# EAGLE design usb-100basefx (EAGLE 6.4)
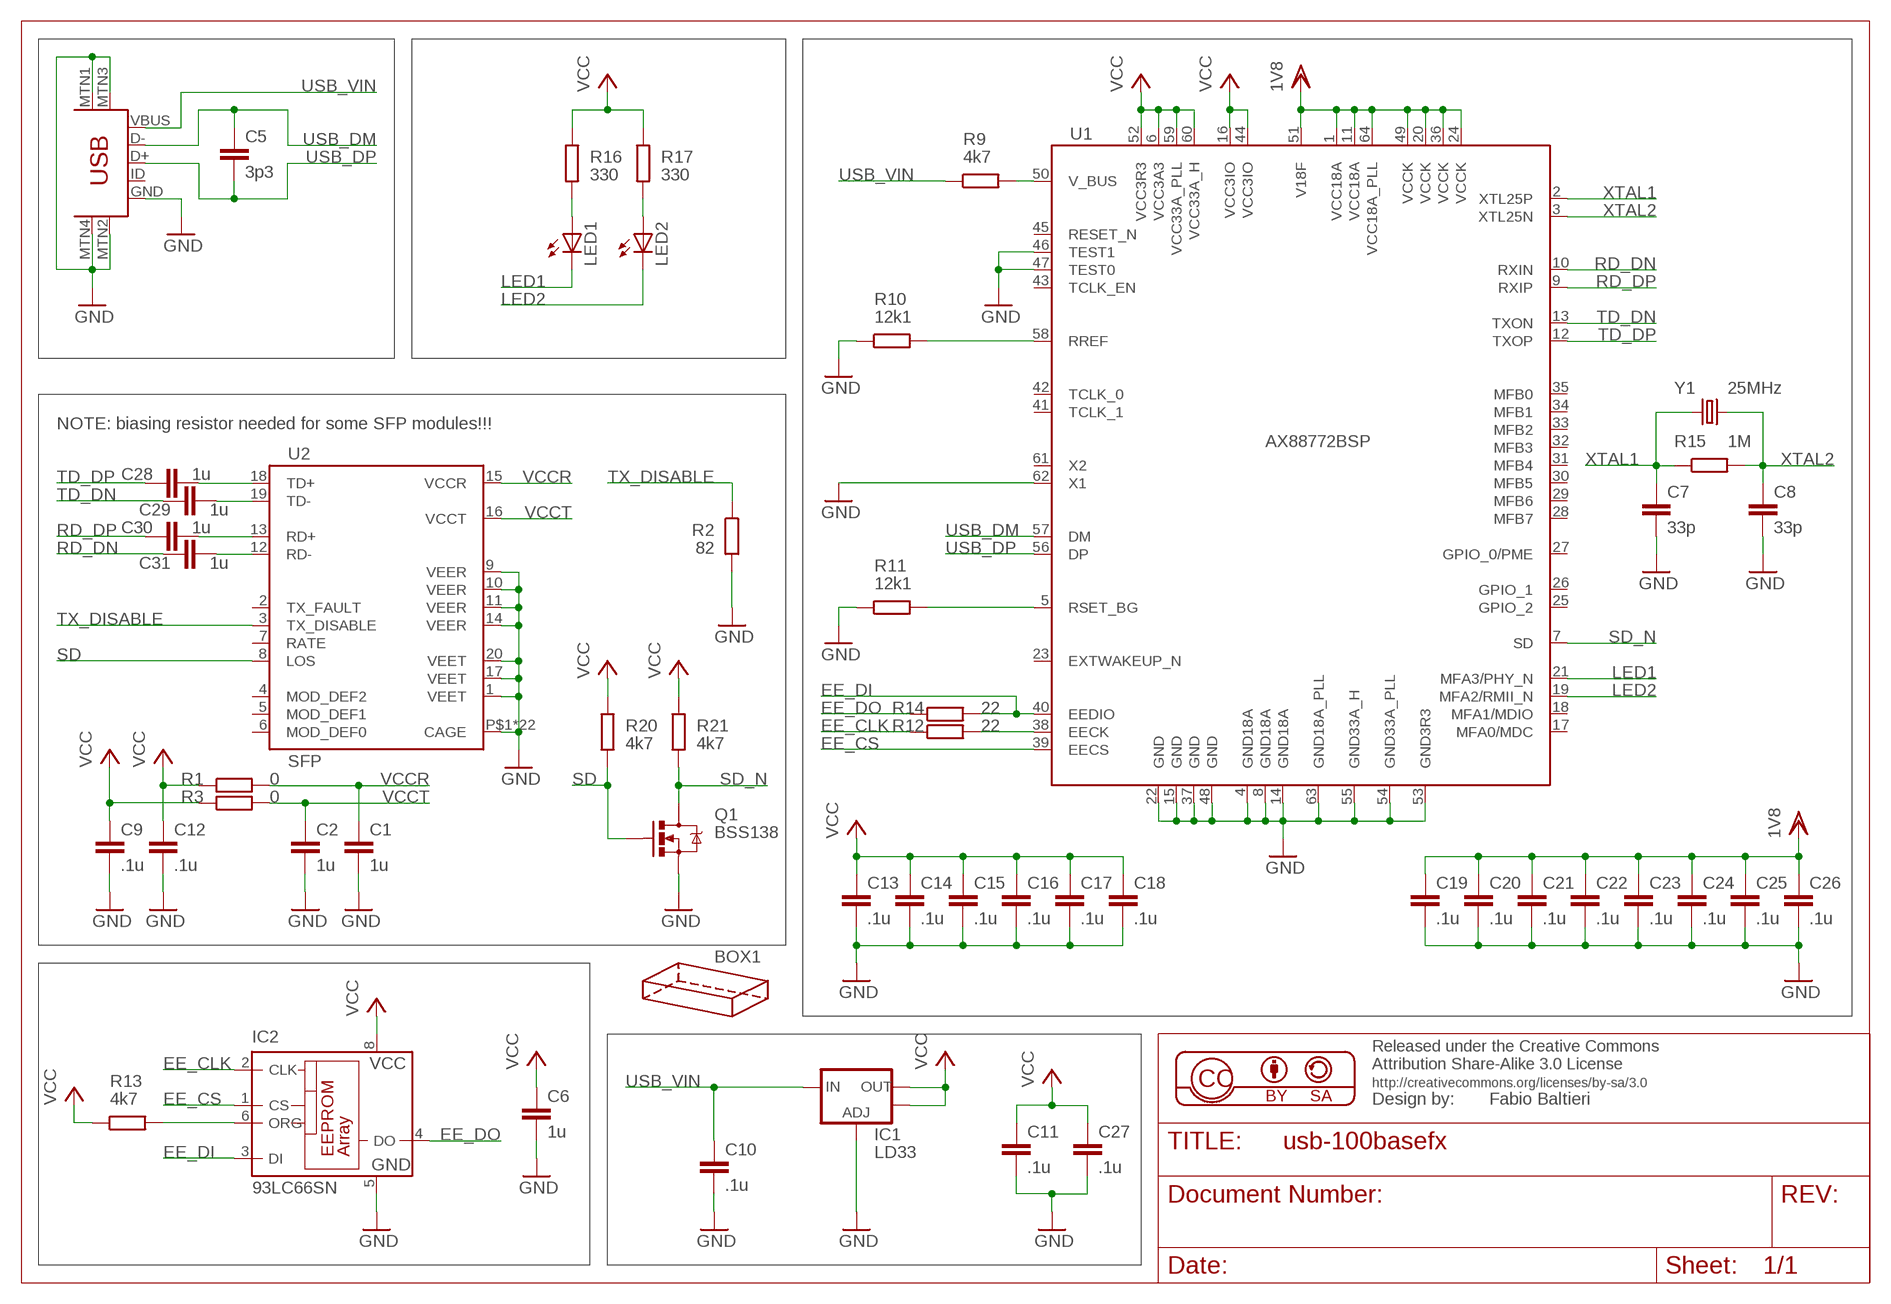
[diagram p0: schematic, sheet 1]

## Parts
BOX1  HAMMOND-BOX-H-1H  [1551H-1HOLE]
C1  1u  C-EUC0603  [C0603]
C2  1u  C-EUC0603  [C0603]
C5  3p3  C-EUC0603  [C0603]
C6  1u  C-EUC0603  [C0603]
C7  33p  C-EUC0603  [C0603]
C8  33p  C-EUC0603  [C0603]
C9  .1u  C-EUC0603  [C0603]
C10  .1u  C-EUC0603  [C0603]
C11  .1u  C-EUC0603  [C0603]
C12  .1u  C-EUC0603  [C0603]
C13  .1u  C-EUC0603  [C0603]
C14  .1u  C-EUC0603  [C0603]
C15  .1u  C-EUC0603  [C0603]
C16  .1u  C-EUC0603  [C0603]
C17  .1u  C-EUC0603  [C0603]
C18  .1u  C-EUC0603  [C0603]
C19  .1u  C-EUC0603  [C0603]
C20  .1u  C-EUC0603  [C0603]
C21  .1u  C-EUC0603  [C0603]
C22  .1u  C-EUC0603  [C0603]
C23  .1u  C-EUC0603  [C0603]
C24  .1u  C-EUC0603  [C0603]
C25  .1u  C-EUC0603  [C0603]
C26  .1u  C-EUC0603  [C0603]
C27  .1u  C-EUC0603  [C0603]
C28  1u  C-EUC0603  [C0603]
C29  1u  C-EUC0603  [C0603]
C30  1u  C-EUC0603  [C0603]
C31  1u  C-EUC0603  [C0603]
IC1  LD33  V_REG_LM1117SOT223  [SOT223]
IC2  93LC66SN  [SO-08]
LED1  LEDCHIPLED_0805  [CHIPLED_0805]
LED2  LEDCHIPLED_0805  [CHIPLED_0805]
Q1  BSS138  MOSFET-NCHANNELBSS123LT1G  [SOT23]
R1  0  R-EU_R0603  [R0603]
R2  82  R-EU_R0603  [R0603]
R3  0  R-EU_R0603  [R0603]
R9  4k7  R-EU_R0603  [R0603]
R10  12k1  R-EU_R0603  [R0603]
R11  12k1  R-EU_R0603  [R0603]
R12  22  R-EU_R0603  [R0603]
R13  4k7  R-EU_R0603  [R0603]
R14  22  R-EU_R0603  [R0603]
R15  1M  R-EU_R0603  [R0603]
R16  330  R-EU_R0603  [R0603]
R17  330  R-EU_R0603  [R0603]
R20  4k7  R-EU_R0603  [R0603]
R21  4k7  R-EU_R0603  [R0603]
U1  AX88772BSP  [LQFP64-0.4MM-SHORTPAD]
U2  SFP  [SFP]
U$1  USB-MINIB-5PIN  [USB-MINIB]
Y1  25MHz  CRYSTAL5X3  [CRYSTAL-SMD-5X3]

## Nets
EE_CLK: IC2.2(CLK) R12.1
EE_CS: IC2.1(CS) U1.39(EECS)
EE_DI: IC2.3(DI) R14.2 U1.40(EEDIO)
EE_DO: IC2.4(DO) R14.1
GND: C1.2 C2.2 C6.2 C7.2 C8.2 C9.2 C10.2 C11.2 C12.2 C13.2 C14.2 C15.2 C16.2 C17.2 C18.2 C19.2 C20.2 C21.2 C22.2 C23.2 C24.2 C25.2 C26.2 C27.2 IC1.1(ADJ) IC2.5(GND) Q1.2(S) R2.2 R10.1 R11.1 U1.4(GND18A) U1.8(GND18A) U1.14(GND18A) U1.15(GND) U1.22(GND) U1.37(GND) U1.46(TEST1) U1.47(TEST0) U1.48(GND) U1.53(GND3R3) U1.54(GND33A_PLL) U1.55(GND33A_H) U1.62(X1) U1.63(GND18A_PLL) U2.1(VEET) U2.9(VEER) U2.10(VEER) U2.11(VEER) U2.14(VEER) U2.17(VEET) U2.20(VEET) U2.P$1(CAGE) U2.P$2(CAGE) U2.P$3(CAGE) U2.P$4(CAGE) U2.P$5(CAGE) U2.P$6(CAGE) U2.P$7(CAGE) U2.P$8(CAGE) U2.P$9(CAGE) U2.P$10(CAGE) U2.P$11(CAGE) U2.P$12(CAGE) U2.P$13(CAGE) U2.P$14(CAGE) U2.P$15(CAGE) U2.P$16(CAGE) U2.P$17(CAGE) U2.P$18(CAGE) U2.P$19(CAGE) U2.P$20(CAGE) U2.P$21(CAGE) U2.P$22(CAGE) U$1.GND U$1.MTN1(MTN2) U$1.MTN2(MTN3) U$1.MTN3(MTN1) U$1.MTN4
LED1: LED1.C U1.21(MFA3/PHY_N)
LED2: LED2.C U1.19(MFA2/RMII_N)
N$1: R9.2 U1.50(V_BUS)
N$2: R10.2 U1.58(RREF)
N$3: R11.2 U1.5(RSET_BG)
N$4: R12.2 U1.38(EECK)
N$5: IC2.6(ORG) R13.2
N$6: LED1.A R16.2
N$7: LED2.A R17.2
N$8: C29.2 U2.19(TD-)
N$9: C28.2 U2.18(TD+)
N$10: C30.2 U2.13(RD+)
N$11: C31.2 U2.12(RD-)
RD_DN: C31.1 U1.10(RXIN)
RD_DP: C30.1 U1.9(RXIP)
SD: Q1.1(G) R20.2 U2.8(LOS)
SD_N: Q1.3(D) R21.2 U1.7(SD)
TD_DN: C29.1 U1.13(TXON)
TD_DP: C28.1 U1.12(TXOP)
TX_DISABLE: R2.1 U2.3(TX_DISABLE)
USB_DM: C5.1 U1.57(DM) U$1.D-
USB_DP: C5.2 U1.56(DP) U$1.D+
USB_VIN: C10.1 IC1.3(IN) R9.1 U$1.VBUS
VCC: C6.1 C9.1 C11.1 C12.1 C13.1 C14.1 C15.1 C16.1 C17.1 C18.1 C27.1 IC1.2(OUT) IC1.4(OUT) IC2.8(VCC) R1.1 R3.1 R13.1 R16.1 R17.1 R20.1 R21.1 U1.6(VCC3A3) U1.16(VCC3IO) U1.44(VCC3IO) U1.52(VCC3R3) U1.59(VCC33A_PLL) U1.60(VCC33A_H)
VCCR: C1.1 R1.2 U2.15(VCCR)
VCCT: C2.1 R3.2 U2.16(VCCT)
VDD: C19.1 C20.1 C21.1 C22.1 C23.1 C24.1 C25.1 C26.1 U1.1(VCC18A) U1.11(VCC18A) U1.20(VCCK) U1.24(VCCK) U1.36(VCCK) U1.49(VCCK) U1.51(V18F) U1.64(VCC18A_PLL) ; supply symbol labelled 1V8
XTAL1: C7.1 R15.1 U1.2(XTL25P) Y1.1
XTAL2: C8.1 R15.2 U1.3(XTL25N) Y1.3
Unconnected: IC2.7(NU) U1.17(MFA0/MDC) U1.18(MFA1/MDIO) U1.23(EXTWAKEUP_N) U1.25(GPIO_2) U1.26(GPIO_1) U1.27(GPIO_0/PME) U1.28(MFB7) U1.29(MFB6) U1.30(MFB5) U1.31(MFB4) U1.32(MFB3) U1.33(MFB2) U1.34(MFB1) U1.35(MFB0) U1.41(TCLK_1) U1.42(TCLK_0) U1.43(TCLK_EN) U1.45(RESET_N) U1.61(X2) U2.2(TX_FAULT) U2.4(MOD_DEF2) U2.5(MOD_DEF1) U2.6(MOD_DEF0) U2.7(RATE) U$1.ID

## Notes on the sheet
- NOTE: biasing resistor needed for some SFP modules!!!

## Library data of the parts
BOX1 = hammond:HAMMOND-BOX: Hammond Project boxes Hammond 1551 Transluscent Blue 50x35x20mm 1551GTBU http://www.hammondmfg.com/pdf/1551G.pdf Hammond 1551 Transluscent Blue 50x50x20mm 1551RTBU http://www.hammondmfg.com/pdf/1551R.pdf Hammond 1551 Transluscent Blue 60x35x20mm 1551HTBU http://www.hammondmfg.com/pdf/1551H.pdf Hammond 1551 Transluscent Blue 80x40x20mm 1551KTBU http://www.hammondmfg.com/pdf/1551K.pdf Hammond 1591 Transluscent Blue 100x51x22m m 1591XXATBU http://www.hammondmfg.com/pdf/1591XXA.pdf
C1 C2 C5-C31 = rcl:C-EU: CAPACITOR, European symbol
IC1 = SparkFun-PowerIC:V_REG_LM1117: Voltage Regulator LM1117 Standard adjustable voltage regulator but in SMD form. Spark Fun Electronics SKU : COM-00595
IC2 = microchip:93*: Serial EPROM 1 K/2 K/4 K, low voltage, Microwire; MF: MICROCHIP; MPN: 93LC66/SN; OC_FARNELL: 1296586; OC_NEWARK: 65K1154
LED1 LED2 = led:LED: LED OSRAM: - CHIPLED LG R971, LG N971, LY N971, LG Q971, LY Q971, LO R971, LY R971 LH N974, LH R974 LS Q976, LO Q976, LY Q976 LO Q996 - Hyper CHIPLED LW Q18S LB Q993, LB Q99A, LB R99A - SideLED LS A670, LO A670, LY A670, LG A670, LP A670 LB A673, LV A673, LT A673, LW A673 LH A674 LY A675 LS A676, LA A676, LO A676, LY A676, LW A676 LS A679, LY A679, LG A679 - Hyper Micro SIDELED® LS Y876, LA Y876, LO Y876, LY Y876 LT Y87S - SmartLED LW L88C, LW L88S LB L89C, LB L89S, LG L890 LS L89K, LO L89K, LY L89K LS L896, LA L896, LO L896, LY L896 - TOPLED LS T670, LO T670, LY T670, LG T670, LP T670 LSG T670, LSP T670, LSY T670, LOP T670, LYG T670 LG T671, LOG T671, LSG T671 LB T673, LV T673, LT T673, LW T673 LH T674 LS T676, LA T676, LO T676, LY T676, LB T676, LH T676, LSB T676, LW T676 LB T67C, LV T67C, LT T67C, LS T67K, LO T67K, LY T67K, LW E67C LS E67B, LA E67B, LO E67B, LY E67B, LB E67C, LV E67C, LT E67C LW T67C LS T679, LY T679, LG T679 LS T770, LO T770, LY T770, LG T770, LP T770 LB T773, LV T773, LT T773, LW T773 LH T774 LS E675, LA E675, LY E675, LS T675 LS T776, LA T776, LO T776, LY T776, LB T776 LHGB T686 LT T68C, LB T68C - Hyper Mini TOPLED® LB M676 - Mini TOPLED Santana® LG M470 LS M47K, LO M47K, LY M47K Source: http://www.osram.convergy.de LUXEON: - LUMILED® LXK2-PW12-R00, LXK2-PW12-S00, LXK2-PW14-U00, LXK2-PW14-V00 LXK2-PM12-R00, LXK2-PM12-S00, LXK2-PM14-U00 LXK2-PE12-Q00, LXK2-PE12-R00, LXK2-PE12-S00, LXK2-PE14-T00, LXK2-PE14-U00 LXK2-PB12-K00, LXK2-PB12-L00, LXK2-PB12-M00, LXK2-PB14-N00, LXK2-PB14-P00, LXK2-PB14-Q00 LXK2-PR12-L00, LXK2-PR12-M00, LXK2-PR14-Q00, LXK2-PR14-R00 LXK2-PD12-Q00, LXK2-PD12-R00, LXK2-PD12-S00 LXK2-PH12-R00, LXK2-PH12-S00 LXK2-PL12-P00, LXK2-PL12-Q00, LXK2-PL12-R00 Source: www.luxeon.com KINGBRIGHT: KA-3528ASYC Source: www.kingbright.com
Q1 = SparkFun-DiscreteSemi:MOSFET-NCHANNEL: Common NMOSFET Parts MFG P/N Store ID Prod ID FDD8780 TRANS-09984 SI7820DN TRANS-11055 FDS6630A IC-08089 2N7002PW TRANS-11151 FQP30N06L COM-10213 TRANS-10060 BSS123LT1G TRANS-08345 BSS138 TRANS-00830 BS170 2N7000; PROD_ID: TRANS-08345
R1-R3 R9-R17 R20 R21 = rcl:R-EU_: RESISTOR, European symbol
U1 = balto:AX88772B: AX88772BLF / AX88772BLI Low-power
U2 = balto:SFP: SFP Cage and Connector
U$1 = SparkFun-Connectors:USB-MINIB: Mini-USB "B" connector with 5th pin broken out. Created new symbol breaking out 5th "ID" pin in mini/micro USB connector spec. See: http://en.wikipedia.org/wiki/Mini_usb#Cables. Uses same footprint as 4-pin symbol. Also added pins to connect to mounting / shield pads if required (probably not generally needed as signals aren't shielded once they leave the connector).
Y1 = SparkFun-FreqCtrl:CRYSTAL: Various standard crystals. Proven footprints. Spark Fun Electronics SKU : COM-00534

## Board
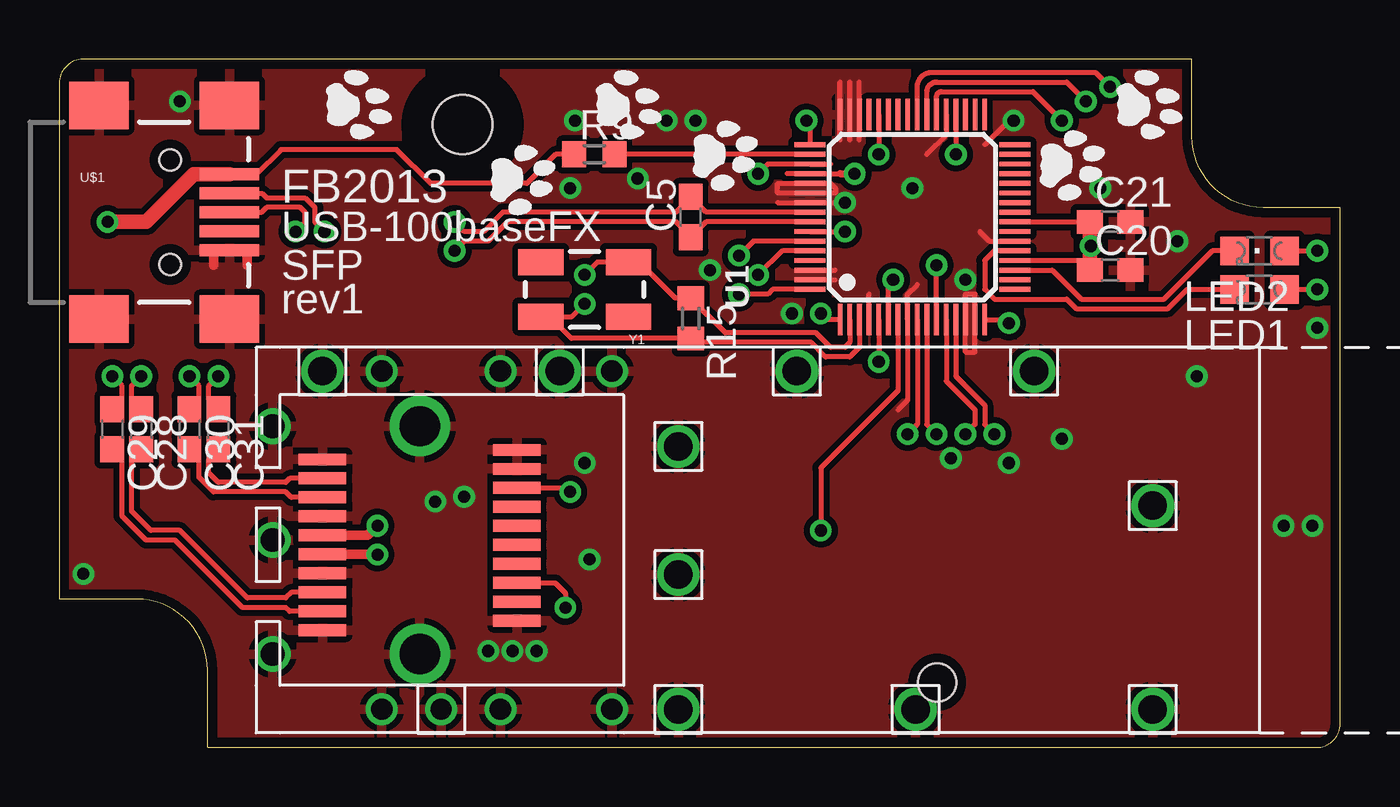
[diagram p1: board, top side]
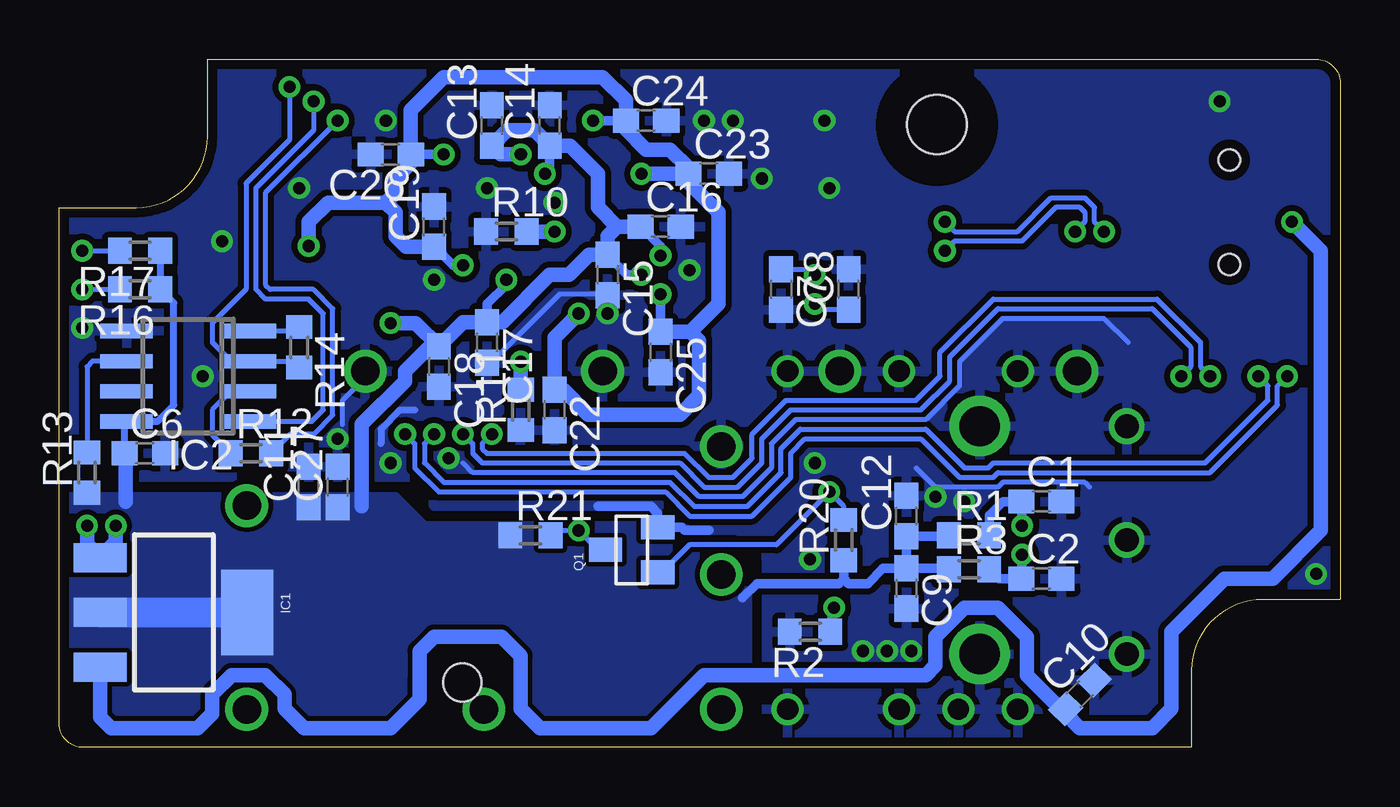
[diagram p2: board, bottom side, seen from below]

Size 54 x 29 mm. Coordinates in mm from the lower left corner, seen from the top.
Copper layers (1*16): Top 0.035mm / dielectric 1.5mm / Bottom 0.035mm
Design rules "balto": minimum track width 8mil, minimum drill 20mil, track to track 8mil, track to pad 8mil, pad to pad 8mil, via to via 8mil, smd to smd 8mil, copper to edge 16mil, drill to drill 8mil, minimum pad ring 8mil, minimum via ring 8mil, stop-mask expansion 2mil, vias tented up to drill 20mil, thermal gap 10mil
Holes 1.6 mm at 37.01,2.74

### Footprints (pad centres in the part's own frame; a part is rotated, then mirrored left to right if it is on the bottom)
1551H-1HOLE = hole 2.5: 17,26.25
C0603 = smd 1.1 x 1: 1 -0.85,0; 2 0.85,0
SOT223 = smd 1.219 x 2.235: 1 -2.311,-3.099; 2 0,-3.099; 3 2.311,-3.099 | smd 3.6 x 2.2: 4 0,3.099
SO-08 = smd 0.6 x 2.2: 1 -1.905,-2.6; 2 -0.635,-2.6; 3 0.635,-2.6; 4 1.905,-2.6; 5 1.905,2.6; 6 0.635,2.6; 7 -0.635,2.6; 8 -1.905,2.6
CHIPLED_0805 = smd 1.2 x 1.2: A 0,-1.05; C 0,1.05
SOT23 = smd 1 x 1.4: 1 -0.95,-1.1; 2 0.95,-1.1; 3 0,1.1
R0603 = smd 1 x 1.1: 1 -0.85,0; 2 0.85,0
LQFP64-0.4MM-SHORTPAD = smd 0.203 x 1.321: 1 -3.048,-4.318; 2 -2.642,-4.318; 3 -2.235,-4.318; 4 -1.829,-4.318; 5 -1.422,-4.318; 6 -1.016,-4.318; 7 -0.61,-4.318; 8 -0.203,-4.318; 9 0.203,-4.318; 10 0.61,-4.318; 11 1.016,-4.318; 12 1.422,-4.318; 13 1.829,-4.318; 14 2.235,-4.318; 15 2.642,-4.318; 16 3.048,-4.318; 33 3.048,4.318; 34 2.642,4.318; 35 2.235,4.318; 36 1.829,4.318; 37 1.422,4.318; 38 1.016,4.318; 39 0.61,4.318; 40 0.203,4.318; 41 -0.203,4.318; 42 -0.61,4.318; 43 -1.016,4.318; 44 -1.422,4.318; 45 -1.829,4.318; 46 -2.235,4.318; 47 -2.642,4.318; 48 -3.048,4.318 | smd 1.321 x 0.203: 17 4.318,-3.048; 18 4.318,-2.642; 19 4.318,-2.235; 20 4.318,-1.829; 21 4.318,-1.422; 22 4.318,-1.016; 23 4.318,-0.61; 24 4.318,-0.203; 25 4.318,0.203; 26 4.318,0.61; 27 4.318,1.016; 28 4.318,1.422; 29 4.318,1.829; 30 4.318,2.235; 31 4.318,2.642; 32 4.318,3.048; 49 -4.318,3.048; 50 -4.318,2.642; 51 -4.318,2.235; 52 -4.318,1.829; 53 -4.318,1.422; 54 -4.318,1.016; 55 -4.318,0.61; 56 -4.318,0.203; 57 -4.318,-0.203; 58 -4.318,-0.61; 59 -4.318,-1.016; 60 -4.318,-1.422; 61 -4.318,-1.829; 62 -4.318,-2.235; 63 -4.318,-2.642; 64 -4.318,-3.048
SFP = smd 2 x 0.5: 1 31.3,3.4; 2 31.3,2.6; 3 31.3,1.8; 4 31.3,1; 5 31.3,0.2; 6 31.3,-0.6; 7 31.3,-1.4; 8 31.3,-2.2; 9 31.3,-3; 10 31.3,-3.8; 11 39.5,-3.4; 12 39.5,-2.6; 13 39.5,-1.8; 14 39.5,-1; 15 39.5,-0.2; 16 39.5,0.6; 17 39.5,1.4; 18 39.5,2.2; 19 39.5,3; 20 39.5,3.8 | drill 1: P$1 41.6,0; P$2 41.6,-4.8; P$3 41.6,4.8 | drill 0.9: P$4 34.5,7.13; P$6 37,7.13; P$7 37,-7.12; P$8 32,7.13; P$9 32,-7.12; P$11 27.3,7.13; P$12 27.3,-7.12 | drill 1.2: P$5 29.5,-7.12; P$10 39.5,-7.12; P$13 24.5,7.13; P$14 24.5,1.45; P$15 14.5,7.13; P$16 24.5,-3.95; P$17 4.5,7.13; P$18 4.5,-1.45; P$19 19.5,-7.12; P$20 9.5,-7.12 | drill 1.7: P$21 35.4,-4.8; P$22 35.4,4.8
USB-MINIB = smd 2.5 x 0.5: D+ 2.5,0; D- 2.5,0.8; GND 2.5,-1.6; ID 2.5,-0.8; VBUS 2.5,1.6 | smd 2.5 x 2: MTN1 -3,4.5; MTN2 2.5,4.5; MTN3 -3,-4.5; MTN4 2.5,-4.5 | hole 0.9: 0,2.2; 0,-2.2
CRYSTAL-SMD-5X3 = smd 1.9 x 1.1: 1 -1.85,-1.15; 2 1.85,-1.15; 3 1.85,1.15; 4 -1.85,1.15

### Placement (x,y rotation side)
BOX1  0,0 0 top
C1  12.6,10.36 0 bottom
C2  12.6,7.11 0 bottom
C5  26.62,22.35 90 top
C6  50.39,12.4 0 bottom
C7  23.57,19.3 270 bottom
C8  20.73,19.3 90 bottom
C9  18.29,6.71 270 bottom
C10  10.97,2.24 45 bottom
C11  43.48,10.97 90 bottom
C12  18.29,9.75 90 bottom
C13  35.76,26.21 90 bottom
C14  33.32,26.21 90 bottom
C15  30.89,19.91 270 bottom
C16  28.65,21.95 0 bottom
C17  35.97,17.07 270 bottom
C18  38,16.05 270 bottom
C19  38.2,21.95 90 bottom
C20  44.3,20.12 0 top
C21  44.3,22.15 0 top
C22  33.12,14.22 270 bottom
C23  26.62,24.18 0 bottom
C24  29.26,26.42 0 bottom
C25  28.65,16.66 270 bottom
C26  40.03,24.99 180 bottom
C27  42.27,10.97 90 bottom
C28  3.45,13.41 270 top
C29  2.24,13.41 270 top
C30  5.49,13.41 270 top
C31  6.71,13.41 270 top
IC1  49.17,5.69 270 bottom
IC2  48.56,15.65 90 bottom
LED1  50.6,19.3 90 top
LED2  50.6,20.93 90 top
Q1  29.87,8.33 90 bottom
R1  15.65,8.94 0 bottom
R2  22.35,4.88 180 bottom
R3  15.65,7.52 0 bottom
R9  22.56,24.99 0 top
R10  35.15,21.74 0 bottom
R11  34.54,14.22 90 bottom
R12  45.92,12.4 0 bottom
R13  52.83,11.58 90 bottom
R14  43.89,16.87 270 bottom
R15  26.62,18.08 270 top
R16  50.6,19.3 180 bottom
R17  50.6,20.93 180 bottom
R20  20.93,8.74 90 bottom
R21  34.14,8.94 0 bottom
U1  35.97,22.35 0 top
U2  50.6,8.74 180 top
U$1  4.67,22.56 0 top
U$2  [CAT-L]  12.19,27.03 270 top
U$3  [CAT-R]  19.1,23.98 270 top
U$4  [CAT-L]  23.57,27.03 270 top
U$5  [CAT-R]  27.64,24.99 270 top
U$7  [CAT-R]  42.27,24.59 270 top
U$8  [CAT-L]  45.52,27.03 270 top
Y1  22.15,19.3 180 top

### Tracks (layer width: path | path; a pad name or v marks a point on that pad's centre or on a via)
EE_CLK
  Bottom 0.203: 45.09,15.01 IC2.2 46.76,15.01 47.55,14.22 47.55,13.17 R12.1
EE_CS  (via drill 0.51)
  Top 0.203: U1.39 36.58,27.64 arc-90 36.98,28.04 42.47,28.04 v43.28,27.23
  Bottom 0.203: v43.28,27.23 43.28,26.01 45.72,23.57 45.72,19.3 45.31,18.9 43.48,18.9 42.88,18.29 42.88,14.22 43.36,13.74 IC2.1
EE_DI  (via drill 0.51)
  Top 0.203: U1.40 36.17,27.84 arc-90 36.78,28.45 43.69,28.45 v44.3,27.84
  Bottom 0.203: v44.3,27.84 44.3,25.6 46.13,23.77 46.13,19.3 47.55,17.88 47.55,17.07 46.76,16.28 IC2.3 44.16,16.28 R14.2 43.85,16.02
EE_DO
  Bottom 0.203: IC2.4 44.05,17.55 R14.1
GND  (via drill 0.51)
  Top 0.203: U1.62 32.72,20.12 | U1.63 32.72,19.71 | 32.72,22.96 U1.55 30.28,22.96 | 32.92,25.6 U1.48 32.92,28.04 | 33.33,25.6 U1.47 33.33,28.04 | 33.73,25.6 U1.46 33.73,28.04 | U1.37 37.39,25.81 36.58,24.99 | U1.22 39.22,21.34 38.81,21.74 | U1.4 34.14,19.1 | 36.17,19.51 35.76,19.1 U1.8 35.76,14.63 35.36,14.22 | v40.23,26.42 40.03,26.42 39.01,25.4 | U1.54 32.72,23.37 32.72,23.57 32.51,23.77 U1.53 30.28,23.77 30.28,23.37 U1.54 | U1.14 38.2,19.1 38.61,19.1 U1.15 38.61,16.66 38.2,16.66 U1.14
  Top 0.406: 7.92,20.32 7.92,20.95 U$1.GND 6.5,20.95 6.5,20.32
  Bottom 0.203: 8.94,17.07 9.96,18.09 14.22,18.09 16.05,16.26 16.05,15.24 17.48,13.82 22.96,13.82 23.98,12.8 23.98,11.79 25.2,10.57 27.03,10.57 28.04,11.58 36.58,11.58 36.98,11.99 | 10.57,10.97 10.77,11.18 14.22,11.18 14.43,10.97 17.07,10.97 17.88,11.79 | 31.09,19.1 32.92,19.1 35.76,16.26 | 42.06,13.61 42.06,14.63 41.25,15.44
  Bottom 0.305: 39.01,14.22 39.62,14.22 40.44,13.41 40.44,12.8
  Bottom 0.406: 31.29,10.16 29.06,10.16 28.77,9.87 Q1.2 27.77,9.28 27.64,9.14 26.62,9.14
  Bottom 0.61: v52.83,9.35 52.83,8.56 IC1.1 51.61,8.66 v51.61,9.35
  other vias: 5.08,27.23 35.97,23.57 27.43,20.12 43.89,23.57 47.14,21.34 38.2,19.71 47.96,15.65 26.82,26.42 25.6,26.42 21.74,26.42 21.54,23.57 24.38,23.98 33.12,22.96 30.89,18.29 53.04,17.68 1.02,7.32 37.59,12.19 18.08,4.06 19.1,4.06 20.12,4.06 42.27,13 22.35,7.92 17.07,10.57 15.85,10.36 22.15,11.99 40.03,11.99
  pour Top (isolate 0.254): 54.66,-0.61 54.66,30.07 -0.61,30.07 -0.61,-0.61
  pour Bottom (isolate 0.254): -0.2,-0.2 24.18,-0.2 24.18,7.92 25.4,9.14 27.64,9.14 28.65,10.16 38.2,10.16 39.42,11.38 54.25,11.38 54.25,29.67 -0.2,29.67
LED1
  Top 0.203: U1.21 39.42,20.93 39.01,20.52 39.01,19.3 39.42,18.9 42.47,18.9 42.88,18.49 46.74,18.49 47.55,19.3 LED1.C
LED2
  Top 0.203: U1.19 41.86,20.12 43.08,18.9 46.57,18.9 48.6,20.93 LED2.C
N$1
  Top 0.203: U1.50 R9.2
N$2  (via drill 0.51)
  Top 0.203: U1.58 v33.12,21.74
  Bottom 0.61: v33.12,21.74 R10.2
N$3  (via drill 0.51)
  Top 0.203: U1.5 v34.54,16.26
  Bottom 0.61: R11.2 v34.54,16.26
N$4  (via drill 0.51)
  Top 0.203: U1.38 36.98,27.43 arc-90 37.19,27.64 41.05,27.64 v42.27,26.42
  Bottom 0.203: v42.27,26.42 45.31,23.37 45.31,19.51 45.11,19.3 43.28,19.3 42.47,18.49 42.47,14.02 43.28,13.21 44.26,13.21 R12.2
N$5
  Bottom 0.203: IC2.6 52.6,16.28 52.83,16.05 R13.2
N$6  (via drill 0.51)
  Top 0.203: LED1.A v53.03,19.3
  Bottom 0.203: v53.03,19.3 R16.2
N$7  (via drill 0.51)
  Top 0.203: LED2.A v53.03,20.93
  Bottom 0.203: v53.03,20.93 R17.2
N$8
  Top 0.203: U2.19 9.71,5.74 9.55,5.89 7.72,5.89 4.88,8.74 3.66,8.74 2.64,9.75 2.64,12.15 C29.2
N$9
  Top 0.203: U2.18 9.79,6.54 9.55,6.3 7.92,6.3 5.08,9.14 3.86,9.14 3.05,9.96 3.05,12.15 C28.2
N$10
  Top 0.203: U2.13 9.78,10.54 9.55,10.77 6.5,10.77 5.89,11.38 5.89,12.15 C30.2
N$11
  Top 0.203: U2.12 9.71,11.34 9.55,11.18 6.71,11.18 6.3,11.58 6.3,12.15 C31.2
RD_DN  (via drill 0.51)
  Top 0.203: U1.10 36.58,13.61 v36.98,13.21 | C31.1 6.3,14.67 6.3,15.24 v6.71,15.65
  Bottom 0.203: v36.98,13.21 36.58,12.8 36.58,12.39 36.17,11.99 27.84,11.99 26.82,10.97 25.4,10.97 24.38,11.99 24.38,13.01 23.16,14.22 17.68,14.22 16.46,15.44 16.46,16.46 14.43,18.49 7.92,18.49 6.3,16.87 6.3,16.05 v6.71,15.65
RD_DP  (via drill 0.51)
  Top 0.203: U1.9 36.17,13.61 v35.76,13.21 | C30.1 5.89,14.67 5.89,15.24 v5.49,15.65
  Bottom 0.203: v35.76,13.21 36.17,12.8 36.17,12.6 35.97,12.39 27.64,12.39 26.62,11.38 25.6,11.38 24.79,12.19 24.79,13.21 23.37,14.63 17.88,14.63 16.87,15.65 16.87,16.66 14.63,18.9 7.72,18.9 5.89,17.07 5.89,16.05 v5.49,15.65
SD  (via drill 0.51)
  Top 0.203: U2.8 21.37,10.94 v21.54,10.77
  Bottom 0.203: R20.2 20.93,10.16 v21.54,10.77 23.77,8.53 27.43,8.53 28.25,7.72 28.43,7.72 Q1.1
SD_N  (via drill 0.51)
  Top 0.203: U1.7 35.36,15.04 32.11,11.79 v32.11,9.14
  Bottom 0.203: Q1.3 31.29,8.33 v32.11,9.14 33.08,9.14 R21.2
TD_DN  (via drill 0.51)
  Top 0.203: U1.13 37.8,15.65 39.01,14.43 39.01,13.61 v39.42,13.21 | C29.1 2.64,14.67 2.64,15.24 v2.23,15.65
  Bottom 0.203: v39.42,13.21 39.01,12.8 39.01,11.79 38,10.77 28.45,10.77 27.43,9.75 24.79,9.75 23.16,11.38 23.16,12.39 22.55,13.01 17.68,13.01 16.05,11.38 14.63,11.38 14.43,11.58 5.49,11.58 2.64,14.43 2.64,15.24 v2.23,15.65
TD_DP  (via drill 0.51)
  Top 0.203: U1.12 37.39,15.44 38.61,14.22 38.61,13.61 v38.2,13.21 | C28.1 3.05,14.67 3.05,15.24 v3.45,15.65
  Bottom 0.203: v38.2,13.21 38.61,12.8 38.61,11.99 37.8,11.18 28.25,11.18 27.23,10.16 24.99,10.16 23.57,11.58 23.57,12.6 22.76,13.41 17.48,13.41 15.85,11.79 14.83,11.79 14.63,11.99 5.69,11.99 3.05,14.63 3.05,15.24 v3.45,15.65
TX_DISABLE  (via drill 0.51)
  Top 0.203: U2.3 20.9,6.94 21.34,6.5 v21.34,5.89
  Bottom 0.203: R2.1 21.5,5.73 v21.34,5.89
USB_DM  (via drill 0.51)
  Top 0.203: U1.57 27.27,22.15 C5.1 26.62,21.54 26.01,22.15 18.9,22.15 18.09,21.34 17.07,21.34 v16.66,20.93 | 11.06,21.86 v11.18,21.74 10.77,22.15 10.77,22.76 10.36,23.16 8.74,23.16 8.55,23.36 U$1.D-
  Bottom 0.203: v11.18,21.74 10.77,22.15 10.77,22.55 10.97,22.76 11.99,22.76 13.41,21.34 16.26,21.34 v16.66,20.93
USB_DP  (via drill 0.51)
  Top 0.203: U1.56 27.27,22.55 C5.2 26.62,23.16 26.01,22.55 18.69,22.55 17.88,21.74 17.07,21.74 v16.66,22.15 | 10.26,22.05 v9.96,21.74 10.36,22.15 10.36,22.55 10.16,22.76 8.74,22.76 8.53,22.55 U$1.D+
  Bottom 0.203: v9.96,21.74 10.36,22.15 10.36,22.76 10.77,23.16 12.19,23.16 13.61,21.74 16.26,21.74 v16.66,22.15
USB_VIN  (via drill 0.51)
  Top 0.203: U$1.VBUS 8.31,24.16 9.35,25.2 14.22,25.2 15.65,23.77 19.71,23.77 20.93,24.99 R9.1
  Top 0.61: U$1.VBUS 5.66,24.16 3.66,22.15 v2.03,22.15
  Bottom 0.61: v2.03,22.15 0.81,20.93 0.81,9.14 2.85,7.11 4.88,7.11 7.11,4.88 7.11,1.63 7.92,0.81 10.97,0.81 11.57,1.41 C10.1 11.79,1.63 13.21,3.05 13.21,4.67 14.43,5.89 15.85,5.89 17.07,4.67 17.07,3.45 17.48,3.05 26.82,3.05 29.06,0.81 33.73,0.81 34.54,1.63 34.54,3.86 35.36,4.67 38.2,4.67 38.81,4.06 38.81,2.03 40.03,0.81 43.69,0.81 44.5,1.63 44.5,2.23 45.31,3.05 46.74,3.05 47.55,2.23 47.55,1.42 48.16,0.81 51.82,0.81 52.27,1.27 IC1.3 52.15,3.38
VCC  (via drill 0.51)
  Top 0.203: U1.44 v34.54,24.99 | U1.6 34.95,19.51 v35.15,19.71 | U1.16 39.88,18.03 v40.03,17.88 | v28.65,20.73 29.26,21.34 U1.59 | U1.60 30.48,20.93 v29.46,19.91 | 32.92,24.18 U1.52 30.68,24.18
  Top 0.305: 32.92,24.18 v33.53,24.18
  Bottom 0.305: C6.1 51.24,13.66 IC2.8 49.86,13.74 49.17,14.43 49.17,18.73 R16.1 R17.1
  Bottom 0.406: C14.1 33.33,24.38 v33.53,24.18 | C16.1 29.46,21.95 28.65,21.13 v28.65,20.73 | C15.1 30.89,20.73 30.07,19.91 v29.46,19.91 | C17.1 35.97,18.69 35.15,19.51 v35.15,19.71 | C9.1 C12.1 16.53,8.9 R1.1 | C9.1 19.27,7.56 19.91,6.91 20.73,6.91 20.93,7.11 | 20.93,7.11 21.13,6.91 24.59,6.91 25.2,6.3 | C9.1 16.53,7.56 R3.1 | 20.93,7.11 R20.1
  Bottom 0.61: 30.48,21.95 31.29,22.76 31.29,24.18 32.48,25.36 C14.1 33.97,26.01 35.12,26.01 C13.1 35.39,24.99 v34.54,24.99 | 30.48,21.95 30.89,21.54 C15.1 31.66,20.76 32.51,19.91 33.33,19.91 35.32,17.92 C17.1 36.98,17.92 C18.1 | C16.1 30.48,21.95 | 51.21,10.36 51.21,12.36 C6.1 | C18.1 38.98,17.88 v40.03,17.88 | C18.1 38.37,16.9 39.42,15.85 39.42,15.44 41.25,13.61 41.25,10.16
  Bottom 1.27: IC1.2 IC1.4
  pour Bottom (no thermals): 24.99,-0.2 54.46,-0.2 54.25,10.57 39.83,10.57 38.61,9.35 29.06,9.35 28.04,8.33 25.4,8.33 24.99,7.92
VCCR  (via drill 0.51)
  Top 0.406: U2.15 13,8.94 v13.41,9.35
  Bottom 0.406: v13.41,9.35 13.41,10.33 C1.1 14.22,10.36 14.8,9.79 R1.2
VCCT  (via drill 0.51)
  Top 0.406: U2.16 v13.4,8.14 v13.41,8.13
  Bottom 0.406: v13.41,8.13 13.41,7.15 C2.1 14.39,7.11 R3.2
VDD  (via drill 0.51)
  Top 0.203: U1.11 v36.98,20.32 | U1.36 v37.8,24.99 | U1.24 C21.1 | U1.20 43.04,20.52 C20.1 | v29.46,24.18 29.87,24.59 U1.51 32.51,24.59 | v31.5,26.42 31.65,26.26 U1.49 | U1.64 30.07,19.3 29.87,19.1 v28.65,19.1 | U1.1 32.36,18.03 v32.11,18.29
  Top 0.61: C21.1 43.45,21.17 v43.48,21.13 43.45,21.1 C20.1
  Bottom 0.406: v31.5,26.42 C24.1 | C26.1 v37.8,24.99 | C19.1 38.16,21.1 37.39,20.32 v36.98,20.32 | v28.65,19.1 C25.1
  Bottom 0.61: C25.1 27.39,17.51 | 27.39,17.51 26.21,18.69 26.21,22.55 27.47,23.81 C23.1 | v29.46,24.18 C23.1 | C23.1 27.47,24.42 28.25,25.2 29.26,25.2 30.11,26.05 C24.1 30.11,27.27 31.09,28.25 37.8,28.25 39.18,26.86 C26.1 39.18,24.62 39.83,23.98 39.83,23.37 40.23,22.96 | v43.48,21.13 43.48,22.15 42.67,22.96 40.23,22.96 | 40.23,22.96 39.83,22.55 39.83,21.54 39.38,21.1 C19.1 | 27.39,17.51 27.03,17.14 27.03,14.83 27.84,14.02 31.7,14.02 32.75,15.07 C22.1 33.12,17.27 v32.11,18.29
XTAL1  (via drill 0.51)
  Top 0.203: U1.2 33.33,17.07 33.12,16.87 32.51,16.87 31.9,17.48 28.08,17.48 R15.1 25.97,18.93 24.45,20.45 Y1.1 22.69,20.45 v22.15,19.91
  Bottom 0.203: C7.1 22.39,20.15 v22.15,19.91
XTAL2  (via drill 0.51)
  Top 0.203: U1.3 33.73,16.87 33.33,16.46 32.31,16.46 31.7,17.07 26.79,17.07 R15.2 21.58,17.23 20.66,18.15 Y1.3 21.61,18.15 v22.15,18.69
  Bottom 0.203: C8.1 21.91,18.45 v22.15,18.69

### Text on the board
_tsilk: FB2013 | USB-100baseFX | SFP | rev1